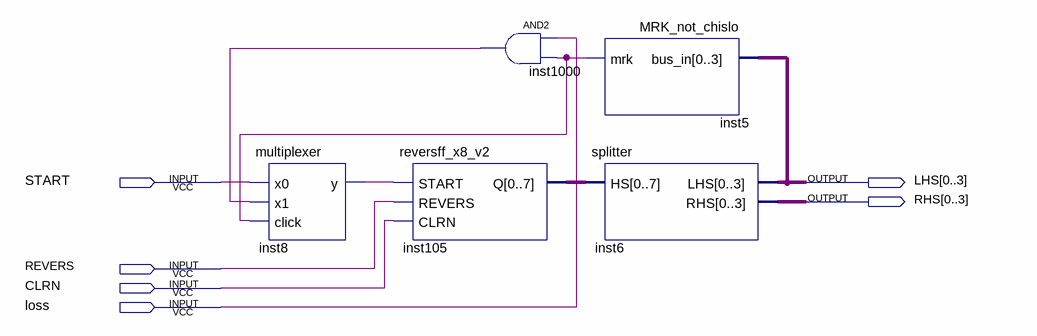
[diagram p0: schematic sheet]
// Quartus schematic CNT_v2.bdf as structural Verilog: 5 symbols, 6 pins
module CNT_v2 (
  input  START,
  input  REVERS,
  input  CLRN,
  input  loss,
  output [0:3] LHS,
  output [0:3] RHS
);

  wire inst5_mrk, inst8_y, inst1000_out;
  wire [7:0] inst105_q;

  multiplexer inst8 (.x0(START), .x1(inst1000_out), .click(inst5_mrk), .y(inst8_y));
  reversff_x8_v2 inst105 (.START(inst8_y), .REVERS(REVERS), .CLRN(CLRN), .Q(inst105_q));
  and inst1000 (inst1000_out, loss, inst5_mrk);
  MRK_not_chislo inst5 (.bus_in(LHS), .mrk(inst5_mrk));
  splitter inst6 (.HS(inst105_q), .LHS(LHS), .RHS(RHS));
endmodule
